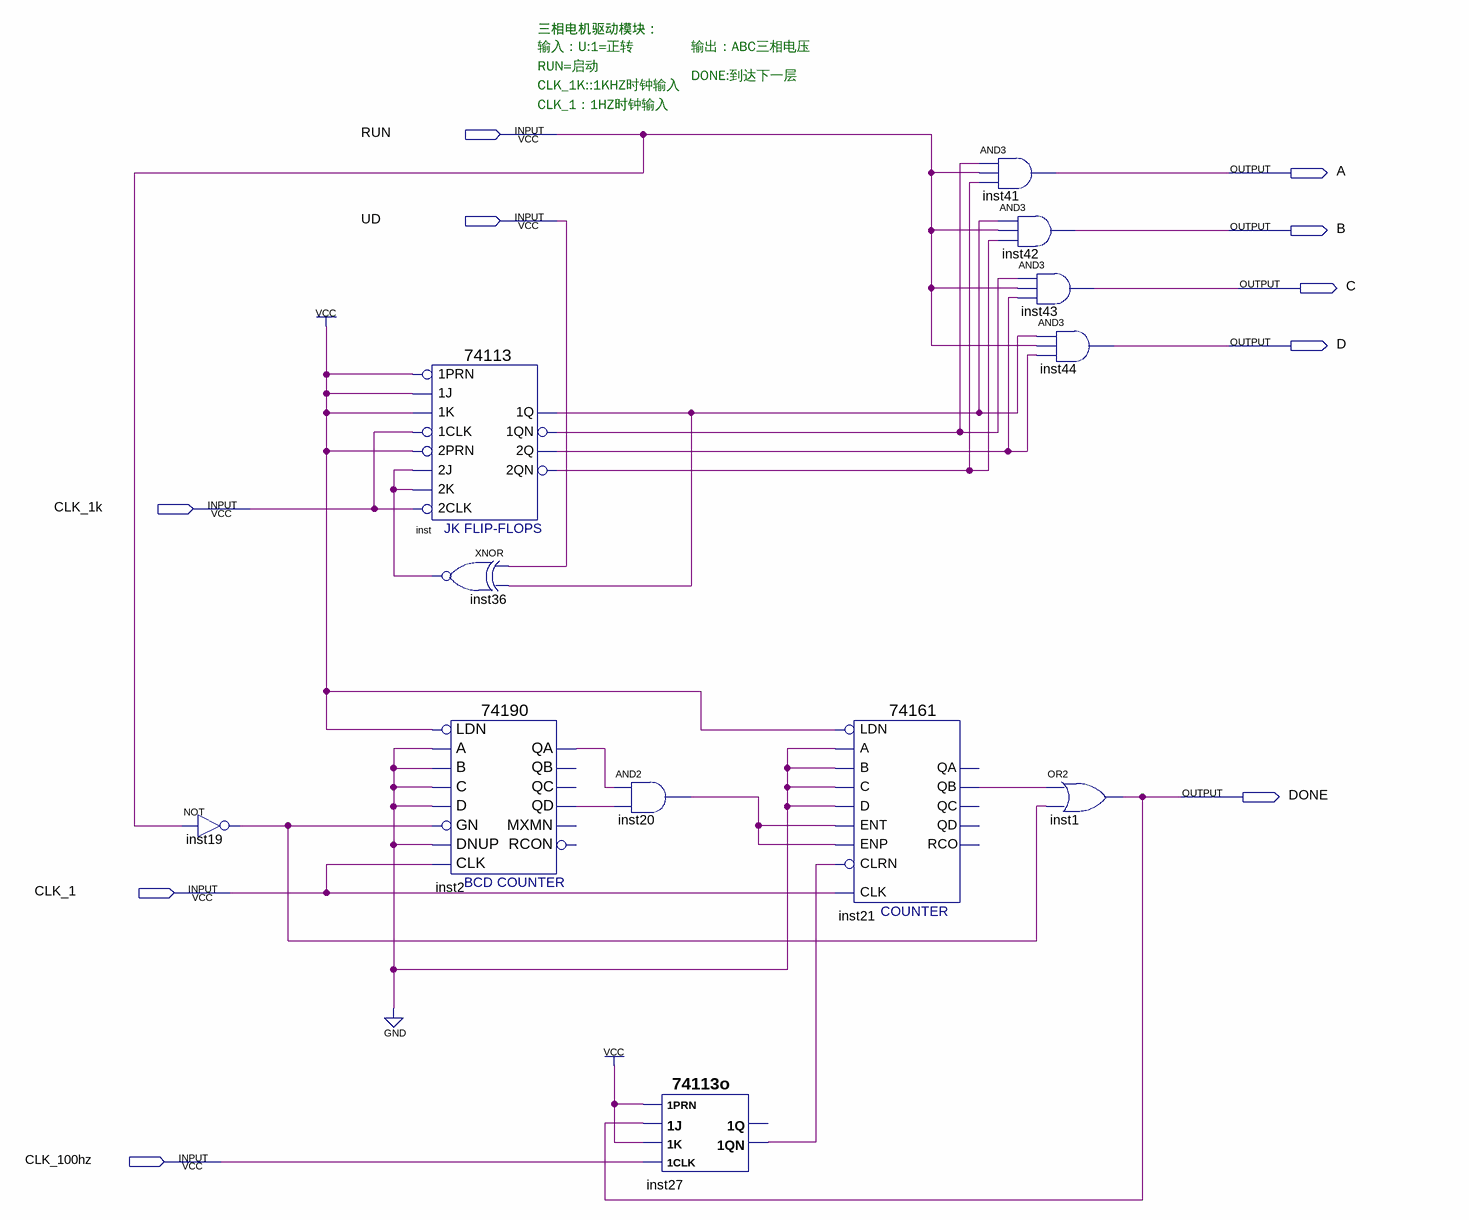
[diagram p0: schematic sheet]
// Quartus schematic motion.bdf as structural Verilog: 12 symbols, 10 pins
module motion (
  input  RUN,
  input  UD,
  input  CLK_1k,
  input  CLK_1,
  input  CLK_100hz,
  output A,
  output B,
  output C,
  output D,
  output DONE
);

  wire inst2_qa, inst2_qd, inst19_out, inst20_out, inst21_qb, inst27_1qn, inst36_out, inst_1q, inst_1qn,
       inst_2q, inst_2qn;

  not inst19 (inst19_out, RUN);
  \74113  inst (
    .\1PRN (1'b1), .\2PRN (1'b1), .\1J (1'b1), .\1K (1'b1), .\1CLK (CLK_1k), .\2J (inst36_out),
    .\2K (inst36_out), .\2CLK (CLK_1k), .\1QN (inst_1qn), .\1Q (inst_1q), .\2Q (inst_2q), .\2QN (inst_2qn));
  xnor inst36 (inst36_out, UD, inst_1q);
  \74190  inst2 (
    .LDN(1'b1), .A(1'b0), .C(1'b0), .B(1'b0), .D(1'b0), .GN(inst19_out), .CLK(CLK_1), .DNUP(1'b0),
    .QA(inst2_qa), .QD(inst2_qd));  // open: QB, QC, MXMN, RCON
  and inst20 (inst20_out, inst2_qa, inst2_qd);
  \74113o  inst27 (.\1K (1'b1), .\1J (DONE), .\1CLK (CLK_100hz), .\1PRN (1'b1), .\1QN (inst27_1qn));  // open: 1Q
  \74161  inst21 (
    .CLRN(inst27_1qn), .CLK(CLK_1), .ENP(inst20_out), .LDN(1'b1), .A(1'b0), .D(1'b0), .ENT(inst20_out),
    .B(1'b0), .C(1'b0), .QB(inst21_qb));  // open: QD, QC, QA, RCO
  and inst41 (A, inst_1qn, RUN, inst_2qn);
  and inst42 (B, inst_1q, RUN, inst_2qn);
  and inst43 (C, inst_1qn, RUN, inst_2q);
  and inst44 (D, inst_1q, RUN, inst_2q);
  or inst1 (DONE, inst21_qb, inst19_out);

  // Notes on the sheet:
  //   三相电机驱动模块：
  //   输入：U:1=正转
  //   输出：ABC三相电压
  //   RUN=启动
  //   DONE:到达下一层
  //   CLK_1K::1KHZ时钟输入
  //   CLK_1：1HZ时钟输入
endmodule
